# Altium schematic sheet mcu.SchDoc
size A3; DocumentNumber: 3; SheetNumber: 3; SheetTotal: 7
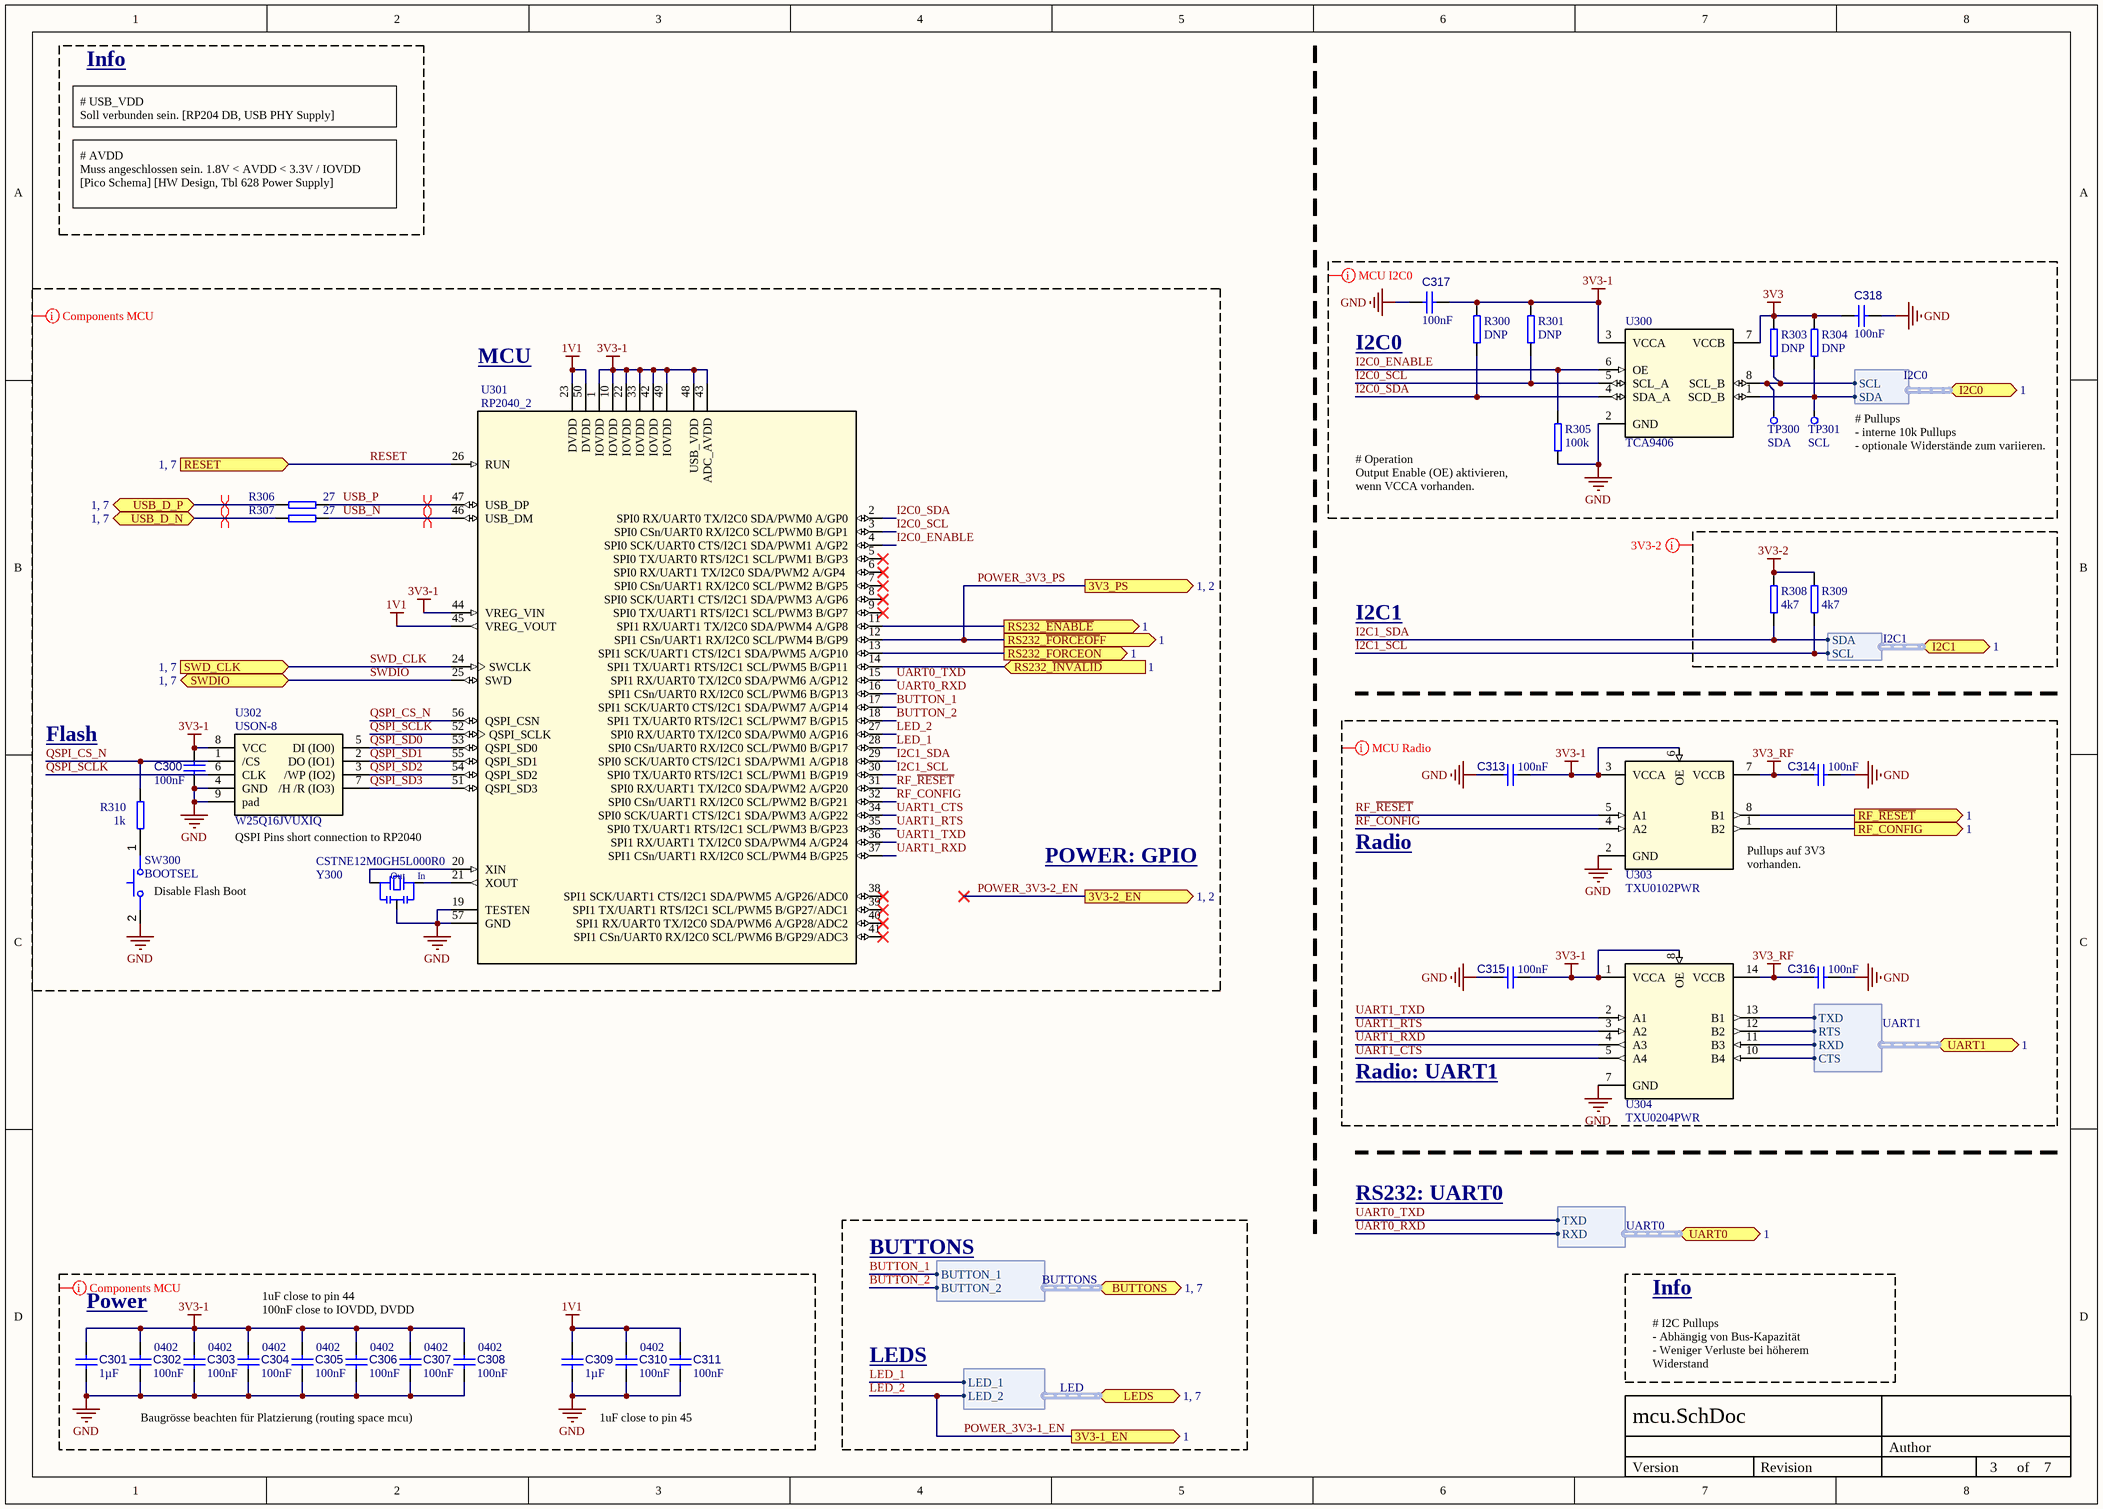
[diagram p0: mcu.SchDoc]

## Parts
C300  value 100nF  [0402]  (hidden comment: Capacitor 0402)
C301  1µF  [0402]
C302  value 100nF  [0402]  (hidden comment: Capacitor 0402)
C303  value 100nF  [0402]  (hidden comment: Capacitor 0402)
C304  value 100nF  [0402]  (hidden comment: Capacitor 0402)
C305  value 100nF  [0402]  (hidden comment: Capacitor 0402)
C306  value 100nF  [0402]  (hidden comment: Capacitor 0402)
C307  value 100nF  [0402]  (hidden comment: Capacitor 0402)
C308  value 100nF  [0402]  (hidden comment: Capacitor 0402)
C309  1µF  [0402]
C310  value 100nF  [0402]  (hidden comment: Capacitor 0402)
C311  value 100nF  [0402]  (hidden comment: Capacitor 0402)
C313  value 100nF  [0603]
C314  value 100nF  [0603]
C315  value 100nF  [0603]
C316  value 100nF  [0603]
C317  value 100nF  [0603]
C318  value 100nF  [0603]
R300  DNP  [0603]
R301  DNP  [0603]
R303  DNP  [0603]
R304  DNP  [0603]
R305  100k  [0603]
R306  27  [0603]
R307  27  [0603]
R308  4k7  [0603]
R309  4k7  [0603]
R310  1k  [0603]
SW300  BOOTSEL  [SWITCH_B3FS1010P]
TP300  Name: SDA  [TP+245X165]  (hidden comment: TP_SMD)
TP301  Name: SCL  [TP+245X165]  (hidden comment: TP_SMD)
U300  TCA9406  [VSSOP_SOP50P310X90-8N]
U301  RP2040_2  [QFN40P700X700X90-57N]
U302  W25Q16JVUXIQ  Case: USON-8  [SON50P300X200X60-9N]
U303  TXU0102PWR  [VFSOP-8]
U304  TXU0204PWR  [TSSOP-14]
Y300  CSTNE12M0GH5L000R0  [OSC_CSTNE12M0GH5L000R0]

## Ports
3V3-1_EN (out, see 1), 3V3-2_EN (out, see 1, 2), 3V3_PS (out, see 1, 2), BUTTONS (bidir, harness BUTTONS, see 1, 7), I2C0 (bidir, harness I2C0, see 1), I2C1 (bidir, harness I2C1, see 1), LEDS (bidir, harness LED, see 1, 7), RESET (in, see 1, 7), RF_CONFIG (out, see 1), RF_~{RESET} (out, see 1), RS232_FORCEON (out, see 1), RS232_~{ENABLE} (out, see 1), RS232_~{FORCEOF}F (out, see 1), RS232_~{INVALID} (in, see 1), SWD_CLK (in, see 1, 7), SWDIO (bidir, see 1, 7), UART0 (bidir, harness UART0, see 1), UART1 (bidir, harness UART1, see 1), USB_D_N (bidir, see 1, 7), USB_D_P (bidir, see 1, 7)

## Harnesses
I2C1: SDA, SCL
I2C0: SDA, SCL
UART0: TXD, RXD
UART1: CTS, RTS, TXD, RXD
BUTTONS: BUTTON_1, BUTTON_2
LED: LED_2, LED_1

## Nets
1V1: C309.1 C310.1 C311.1 U301.23(DVDD) U301.45(VREG_VOUT) U301.50(DVDD)
3V3: C318.2 R303.1 R304.1 U300.7(VCCB)
3V3-1: C300.1 C301.1 C302.1 C303.1 C304.1 C305.1 C306.1 C307.1 C308.1 C313.2 C315.2 C317.1 R300.1 R301.1 U300.3(VCCA) U301.1(IOVDD) U301.10(IOVDD) U301.22(IOVDD) U301.33(IOVDD) U301.42(IOVDD) U301.43(ADC_AVDD) U301.44(VREG_VIN) U301.48(USB_VDD) U301.49(IOVDD) U302.8(VCC) U303.3(VCCA) U303.6(OE) U304.1(VCCA) U304.8(OE)
3V3-2: R308.1 R309.1
3V3_RF: C314.1 C316.1 U303.7(VCCB) U304.14(VCCB)
GND: C300.2 C301.2 C302.2 C303.2 C304.2 C305.2 C306.2 C307.2 C308.2 C309.2 C310.2 C311.2 C313.1 C314.2 C315.1 C316.2 C317.2 C318.1 R305.2 SW300.2 U300.2(GND) U301.19(TESTEN) U301.57(GND) U302.4(GND) U302.9(pad) U303.2(GND) U304.7(GND) Y300.2(GND)
BUTTON_1: U301.17(SPI1_SCK/UART0_CTS/I2C1_SDA/PWM7_A/GP14) ; port BUTTONS.BUTTON_1
BUTTON_2: U301.18(SPI1_TX/UART0_RTS/I2C1_SCL/PWM7_B/GP15) ; port BUTTONS.BUTTON_2
I2C0_ENABLE: R305.1 U300.6(OE) U301.4(SPI0_SCK/UART0_CTS/I2C1_SDA/PWM1_A/GP2)
I2C0_SCL: R301.2 U300.5(SCL_A) U301.3(SPI0_CSn/UART0_RX/I2C0_SCL/PWM0_B/GP1)
I2C0_SDA: R300.2 U300.4(SDA_A) U301.2(SPI0_RX/UART0_TX/I2C0_SDA/PWM0_A/GP0)
I2C1_SCL: R309.2 U301.30(SPI0_TX/UART0_RTS/I2C1_SCL/PWM1_B/GP19) ; port I2C1.SCL
I2C1_SDA: R308.2 U301.29(SPI0_SCK/UART0_CTS/I2C1_SDA/PWM1_A/GP18) ; port I2C1.SDA
LED_1: U301.28(SPI0_CSn/UART0_RX/I2C0_SCL/PWM0_B/GP17) ; port LEDS.LED_1
LED_2: U301.27(SPI0_RX/UART0_TX/I2C0_SDA/PWM0_A/GP16) ; port 3V3-1_EN, port LEDS.LED_2  [also labelled POWER_3V3-1_EN]
POWER_3V3-2_EN: port 3V3-2_EN
POWER_3V3_PS: U301.12(SPI1_CSn/UART1_RX/I2C0_SCL/PWM4_B/GP9) ; port 3V3_PS, port RS232_~{FORCEOF}F
QSPI_CS_N: R310.2 U301.56(QSPI_CSN) U302.1(/CS)
QSPI_SCLK: U301.52(QSPI_SCLK) U302.6(CLK)
QSPI_SD0: U301.53(QSPI_SD0) U302.5(DI_(IO0))
QSPI_SD1: U301.55(QSPI_SD1) U302.2(DO_(IO1))
QSPI_SD2: U301.54(QSPI_SD2) U302.3(/WP_(IO2))
QSPI_SD3: U301.51(QSPI_SD3) U302.7(/H_/R_(IO3))
RESET: U301.26(RUN) ; port RESET
RF_CONFIG: U301.32(SPI0_CSn/UART1_RX/I2C0_SCL/PWM2_B/GP21) U303.4(A2)
RF_CONFIG: U303.1(B2) ; port RF_CONFIG  [a separate net that carries the same name]
RF_~{RESET}: U301.31(SPI0_RX/UART1_TX/I2C0_SDA/PWM2_A/GP20) U303.5(A1)
RF_~{RESET}: U303.8(B1) ; port RF_~{RESET}  [a separate net that carries the same name]
RS232_~{ENABLE}: U301.11(SPI1_RX/UART1_TX/I2C0_SDA/PWM4_A/GP8) ; port RS232_~{ENABLE}
RS232_FORCEON: U301.13(SPI1_SCK/UART1_CTS/I2C1_SDA/PWM5_A/GP10) ; port RS232_FORCEON
RS232_~{INVALID}: U301.14(SPI1_TX/UART1_RTS/I2C1_SCL/PWM5_B/GP11) ; port RS232_~{INVALID}
SWD_CLK: U301.24(SWCLK) ; port SWD_CLK
SWDIO: U301.25(SWD) ; port SWDIO
UART0_RXD: U301.16(SPI1_CSn/UART0_RX/I2C0_SCL/PWM6_B/GP13) ; port UART0.RXD
UART0_TXD: U301.15(SPI1_RX/UART0_TX/I2C0_SDA/PWM6_A/GP12) ; port UART0.TXD
UART1_CTS: U301.34(SPI0_SCK/UART1_CTS/I2C1_SDA/PWM3_A/GP22) U304.5(A4)
UART1_RTS: U301.35(SPI0_TX/UART1_RTS/I2C1_SCL/PWM3_B/GP23) U304.3(A2)
UART1_RXD: U301.37(SPI1_CSn/UART1_RX/I2C0_SCL/PWM4_B/GP25) U304.4(A3)
UART1_TXD: U301.36(SPI1_RX/UART1_TX/I2C0_SDA/PWM4_A/GP24) U304.2(A1)
USB_D_N: R307.2 ; port USB_D_N
USB_D_P: R306.2 ; port USB_D_P
USB_N: R307.1 U301.46(USB_DM)
USB_P: R306.1 U301.47(USB_DP)
NetR303_2: R303.2 TP300.1 U300.8(SCL_B) ; port I2C0.SCL
NetR304_2: R304.2 TP301.1 U300.1(SCD_B) ; port I2C0.SDA
NetR310_1: R310.1 SW300.1
NetU301_20: U301.20(XIN) Y300.3
NetU301_21: U301.21(XOUT) Y300.1
NetU304_10: U304.10(B4) ; port UART1.CTS
NetU304_11: U304.11(B3) ; port UART1.RXD
NetU304_12: U304.12(B2) ; port UART1.RTS
NetU304_13: U304.13(B1) ; port UART1.TXD

Not connected (* = marked no-connect by the designer): U301 5(SPI0_TX/UART0_RTS/I2C1_SCL/PWM1_B/GP3)* 6(SPI0_RX/UART1_TX/I2C0_SDA/PWM2_A/GP4)* 7(SPI0_CSn/UART1_RX/I2C0_SCL/PWM2_B/GP5)* 8(SPI0_SCK/UART1_CTS/I2C1_SDA/PWM3_A/GP6)* 9(SPI0_TX/UART1_RTS/I2C1_SCL/PWM3_B/GP7)* 38(SPI1_SCK/UART1_CTS/I2C1_SDA/PWM5_A/GP26/ADC0)* 39(SPI1_TX/UART1_RTS/I2C1_SCL/PWM5_B/GP27/ADC1)* 40(SPI1_RX/UART0_TX/I2C0_SDA/PWM6_A/GP28/ADC2)* 41(SPI1_CSn/UART0_RX/I2C0_SCL/PWM6_B/GP29/ADC3)*

## Layout directives
differential pair: USB_D_N, USB_D_P, USB_N, USB_P
net class 3V3-2: 3V3-2
CompClassName: MCU_MCU: 1V1, 3V3-1, BUTTON_1, BUTTON_2, GND, I2C0_ENABLE, I2C0_SCL, I2C0_SDA, I2C1_SCL, I2C1_SDA, LED_1, LED_2, POWER_3V3-2_EN, POWER_3V3_PS, QSPI_CS_N, QSPI_SCLK, QSPI_SD0, QSPI_SD1, QSPI_SD2, QSPI_SD3, RESET, RF_CONFIG, RF_~{RESET}, SWD_CLK, SWDIO, UART0_RXD, UART0_TXD, UART1_CTS, UART1_RTS, UART1_RXD, UART1_TXD, USB_N, USB_P
CompClassName: MCU_I2C0: 3V3, 3V3-1, GND, I2C0_ENABLE, I2C0_SCL, I2C0_SDA
CompClassName: MCU_RADIO: 3V3-1, 3V3_RF, GND, RF_CONFIG, RF_~{RESET}, UART1_CTS, UART1_RTS, UART1_RXD, UART1_TXD

## Notes on the sheet
- Info
- # USB_VDD
  Soll verbunden sein. [RP204 DB, USB PHY Supply]
- # AVDD
  Muss angeschlossen sein. 1.8V < AVDD < 3.3V / IOVDD
  [Pico Schema] [HW Design, Tbl 628 Power Supply]
- (near U301) MCU
- (near C317) I2C0
- (near R305) # Operation
  Output Enable (OE) aktivieren, wenn VCCA vorhanden.
- (near TP301) # Pullups
  - interne 10k Pullups
  - optionale Widerstände zum variieren.
- I2C1
- Flash
- QSPI Pins short connection to RP2040
- Radio
- (near SW300) Disable Flash Boot
- POWER: GPIO
- (near U303) Pullups auf 3V3 vorhanden.
- Radio: UART1
- BUTTONS
- RS232: UART0
- Power
- 1uF close to pin 44
  100nF close to IOVDD, DVDD
- LEDS
- # I2C Pullups
  - Abhängig von Bus-Kapazität
  - Weniger Verluste bei höherem Widerstand
- Baugrösse beachten für Platzierung (routing space mcu)
- 1uF close to pin 45
- Author
- Version
- Revision
- of
- (in symbol Crystal_3) Out; In

## Library data of the parts
C300-C311 C313-C318 = C: Manufacturer: Kyocera AVX; Manufacturer Part Number: 04026D105KAT2A; Voltage Rating: 6.3V; Tolerance: 10%; Mounting Technology: SM; Pins: 2; Case/Package: 0402; RoHS Compliant: True; Max Operating Temperature: 85°C; Component Type: Capacitors
  C301 C309: Value: 1µF
R300 R301 R303-R310 = R?: Normaler Widerstand
SW300 = SW_TACTILE_1
TP300 TP301 = Testpoint
U300 = IC_TCA9406: 2-bit bidirectional 1MHz I2C/SMBus voltage level translator with internal pull-up resistor
U301 = RP2040_2: RP2040 chip for Raspberry Pi Pico - ARMÂ® CortexÂ®-M0+ MCU 32-Bit; Check_prices: https://www.snapeda.com/parts/RP2040/Raspberry+Pi/view-part/?ref=eda; Value: *; Availability: In Stock; MP: RP2040; Price: None; Package: None; SnapEDA_Link: https://www.snapeda.com/parts/RP2040/Raspberry+Pi/view-part/?ref=snap; Purchase-URL: https://pricing.snapeda.com/search/part/RP2040/?ref=eda; MF: Raspberry Pi
U302 = W25Q16JVUXIQ: No Description Available; Mfr_Name: Winbond; RefDes: RefDes; Type: Type
U303 = IC_TXU0102: Dual-channel fixed multidirectional level shifter; Supplier 1: Mouser; Supplier Part Number 1: 595-TXU0102DCUR
U304 = IC_TXU0204_TSSOP: Four-channel fixed multidirectional level shifter
Y300 = Crystal_3: SMT Crystal; Value: CSTNE12M0GH5L000R0